# Altium schematic sheet LCD Connectors.SchDoc: LCD Connectors
size A4; DocumentNumber: MB1246; Revision: B.1; SheetNumber: 6; SheetTotal: 17; Project: STM32H7xxI-EVAL
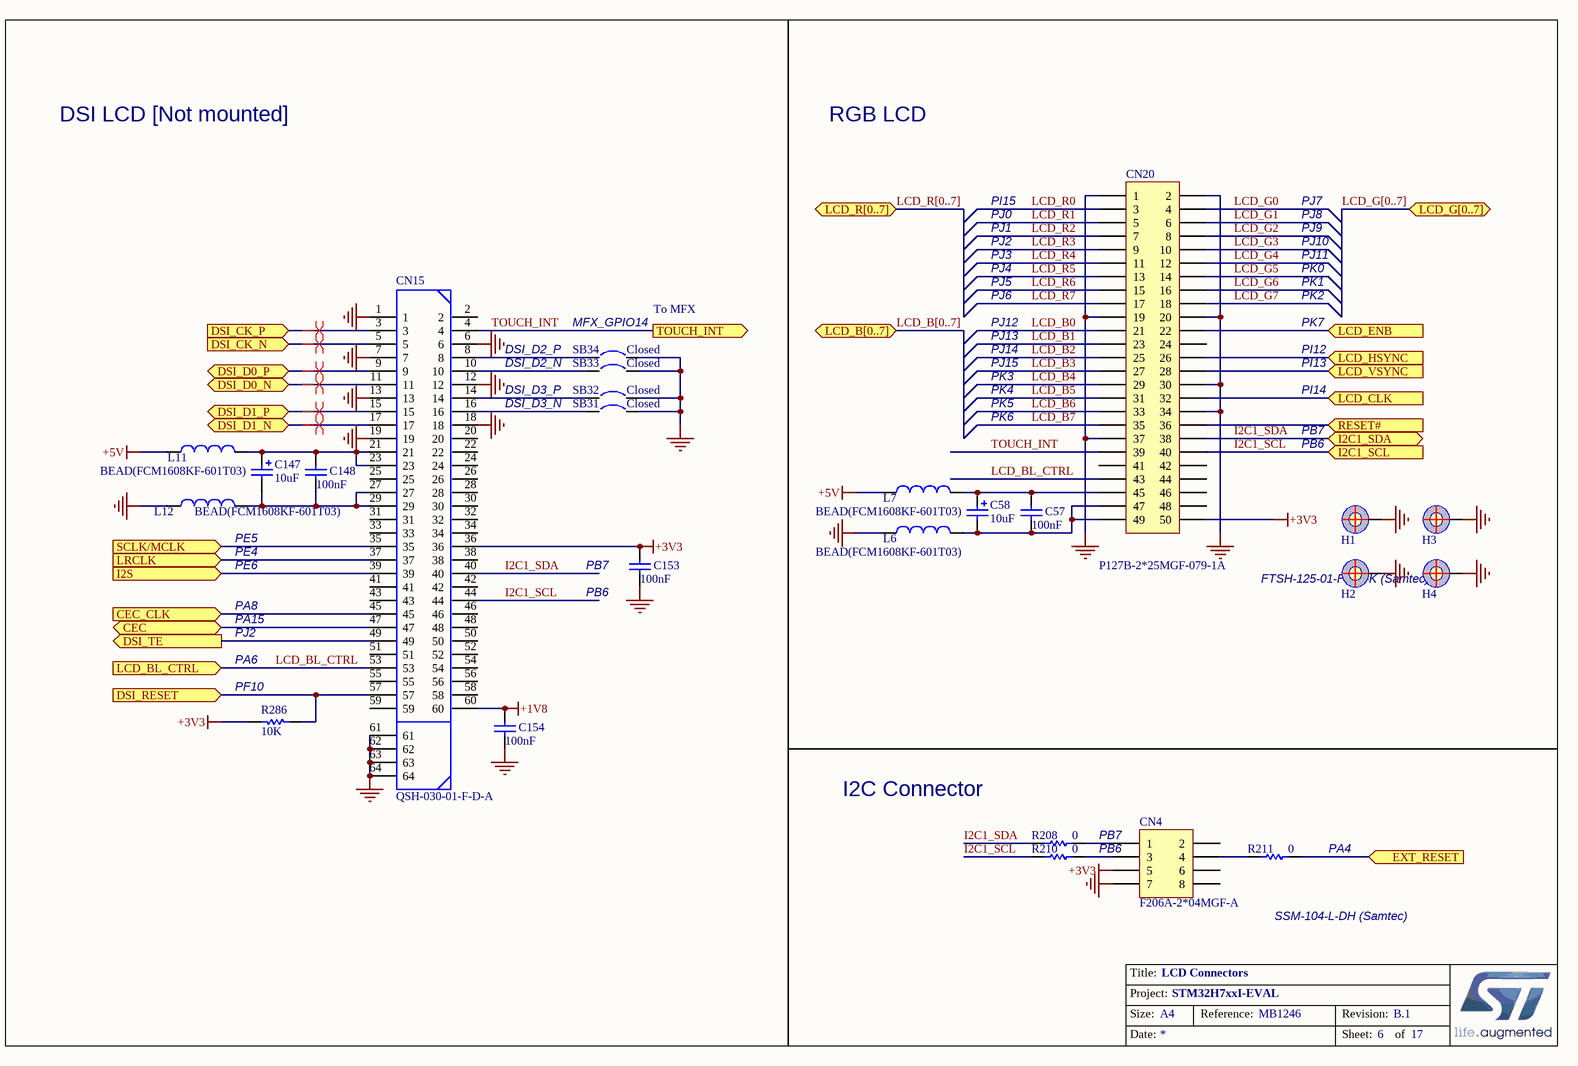
[diagram p0: LCD Connectors.SchDoc]

## Parts
C57  100nF  [0603C]
C58  10uF  [TAN-A]
C147  10uF  [TAN-A]
C148  100nF  [0603C]
C153  100nF  [0603C]
C154  100nF  [0603C]
CN4  F206A-2*04MGF-A  [SSM-104-L-DH]
CN15  QSH-030-01-F-D-A  [QSH-030-01-F-D-A]
CN20  P127B-2*25MGF-079-1A  [FTSH-125-01-F-DV]
H1  POSITION HOLE  [HOLE_C9D4R5]  (value not drawn)
H2  POSITION HOLE  [HOLE_C9D4R5]  (value not drawn)
H3  POSITION HOLE  [HOLE_C9D4R5]  (value not drawn)
H4  POSITION HOLE  [HOLE_C9D4R5]  (value not drawn)
L6  BEAD(FCM1608KF-601T03)  [0603L]
L7  BEAD(FCM1608KF-601T03)  [0603L]
L11  BEAD(FCM1608KF-601T03)  [0603L]
L12  BEAD(FCM1608KF-601T03)  [0603L]
R208  0  [0603R]
R210  0  [0603R]
R211  0  [0603R]
R286  10K  [0603R]
SB31  Closed  [SB_0603]
SB32  Closed  [SB_0603]
SB33  Closed  [SB_0603]
SB34  Closed  [SB_0603]

## Ports
CEC (bidir), CEC_CLK (in), DSI_CK_N (in), DSI_CK_P (in), DSI_D0_N (bidir), DSI_D0_P (bidir), DSI_D1_N (bidir), DSI_D1_P (bidir), DSI_RESET (in), DSI_TE (out), EXT_RESET (in), I2C1_SCL (in), I2C1_SDA (bidir), I2S (in), LCD_B[0..7] (bidir), LCD_BL_CTRL (in), LCD_CLK (in), LCD_ENB (in), LCD_G[0..7] (bidir), LCD_HSYNC (in), LCD_R[0..7] (bidir), LCD_VSYNC (in), LRCLK (in), RESET# (in), SCLK/MCLK (in), TOUCH_INT (out)

## Nets
+1V8: C154.1 CN15.60
+3V3: C153.1 CN4.5 CN15.36 CN20.50 R286.2
+5V: L7.1 L11.1
GND: C153.2 C154.2 CN4.7 CN15.1 CN15.6 CN15.7 CN15.12 CN15.13 CN15.18 CN15.19 CN15.61 CN15.62 CN15.63 CN15.64 CN20.1 CN20.2 CN20.19 CN20.20 CN20.30 CN20.34 CN20.37 H1.1 H2.1 H3.1 H4.1 L6.1 L12.1 SB31.2 SB32.2 SB33.2 SB34.2
CEC: CN15.47 ; port CEC
CEC_CLK: CN15.45 ; port CEC_CLK
DSI_CK_N: CN15.5 ; port DSI_CK_N
DSI_CK_P: CN15.3 ; port DSI_CK_P
DSI_D0_N: CN15.11 ; port DSI_D0_N
DSI_D0_P: CN15.9 ; port DSI_D0_P
DSI_D1_N: CN15.17 ; port DSI_D1_N
DSI_D1_P: CN15.15 ; port DSI_D1_P
DSI_RESET: CN15.57 R286.1 ; port DSI_RESET
DSI_TE: CN15.49 ; port DSI_TE
EXT_RESET: R211.2 ; port EXT_RESET
I2C1_SCL: CN15.44 CN20.40 R210.1 ; port I2C1_SCL
I2C1_SDA: CN15.40 CN20.38 R208.1 ; port I2C1_SDA
I2S: CN15.39 ; port I2S
LCD_B0: CN20.21
LCD_B1: CN20.23
LCD_B2: CN20.25
LCD_B3: CN20.27
LCD_B4: CN20.29
LCD_B5: CN20.31
LCD_B6: CN20.33
LCD_B7: CN20.35
LCD_BL_CTRL: CN15.53 CN20.43 ; port LCD_BL_CTRL
LCD_CLK: CN20.32 ; port LCD_CLK
LCD_ENB: CN20.22 ; port LCD_ENB
LCD_G0: CN20.4
LCD_G1: CN20.6
LCD_G2: CN20.8
LCD_G3: CN20.10
LCD_G4: CN20.12
LCD_G5: CN20.14
LCD_G6: CN20.16
LCD_G7: CN20.18
LCD_HSYNC: CN20.26 ; port LCD_HSYNC
LCD_R0: CN20.3
LCD_R1: CN20.5
LCD_R2: CN20.7
LCD_R3: CN20.9
LCD_R4: CN20.11
LCD_R5: CN20.13
LCD_R6: CN20.15
LCD_R7: CN20.17
LCD_VSYNC: CN20.28 ; port LCD_VSYNC
LRCLK: CN15.37 ; port LRCLK
RESET#: CN20.36 ; port RESET#
SCLK/MCLK: CN15.35 ; port SCLK/MCLK
TOUCH_INT: CN15.4 CN20.39 ; port TOUCH_INT
NetC57_1: C57.1 C58.1 CN20.45 L7.2
NetC57_2: C57.2 C58.2 CN20.47 CN20.49 L6.2
NetC147_1: C147.1 C148.1 CN15.21 CN15.23 L11.2
NetC147_2: C147.2 C148.2 CN15.27 CN15.29 L12.2
NetCN4_1: CN4.1 R208.2
NetCN4_3: CN4.3 R210.2
NetCN4_4: CN4.4 R211.1
NetCN15_8: CN15.8 SB34.1
NetCN15_10: CN15.10 SB33.1
NetCN15_14: CN15.14 SB32.1
NetCN15_16: CN15.16 SB31.1

Not connected (* = marked no-connect by the designer): CN4 2 6 8; CN15 2 20 22 24 25 26 28 30 31 32 33 34 38 41 42 43 46 48 50 51 52 54 55 56 58 59; CN20 24 41 42 44 46 48

## Buses and harness runs
bus LCD_B[0..7] = port LCD_B[0..7]
bus LCD_G[0..7] = port LCD_G[0..7]
bus LCD_R[0..7] = port LCD_R[0..7]

## Layout directives
differential pair: DSI_CK_N, DSI_CK_P, DSI_D0_N, DSI_D0_P, DSI_D1_N, DSI_D1_P

## Notes on the sheet
- DSI LCD [Not mounted]
- RGB LCD
- PI15
- PJ0
- PJ1
- PJ2
- PJ3
- PJ7
- PJ8
- PJ9
- PJ10
- PJ11
- MFX_GPIO14
- To MFX
- PJ4
- PJ5
- PJ6
- PJ12
- PK0
- PK1
- PK2
- PK7
- DSI_D2_P
- DSI_D2_N
- DSI_D3_P
- PJ13
- PJ14
- PJ15
- PK3
- PK4
- PI12
- PI13
- PI14
- DSI_D3_N
- PK5
- PK6
- PB7
- PB6
- PE6
- (near L12) PE5
- (near L12) PE4
- (near C153) PB7
- (near C153) PB6
- FTSH-125-01-F-DV-K (Samtec)
- PA6
- PA15
- PA8
- (near R286) PF10
- I2C Connector
- (near R211) PA4
- (near CN4) SSM-104-L-DH (Samtec)
- Title:
- Project:
- Size:
- Date:
- A4
- Reference:
- Sheet:
- Revision:
- of

## Library data of the parts
C57 C148 C153 C154 = Cap: Capacitor; Value: 10nF; Published: 8-Jun-2000; Revision: July-2002: Re-released for DXP Platform.; Publisher: Altium Limited
C58 C147 = Cap Pol1: Polarized Capacitor (Radial); Published: 8-Jun-2000; Revision: July-2002: Re-released for DXP Platform.; Publisher: Altium Limited; Value: 10uF
CN4 = SSM-104-L-DH: Header, 5-Pin, Dual row; Revision: 17-Jul-2002: Re-released for DXP Platform.; Publisher: Altium Limited
CN15 = QSH-030-01-F-D-A: HIGH SPEED SOCKET STRIP, .5mm PITCH, 60 PINS; MANUFACTURER: SAMTEC; PCB DECAL: QSH-030-01-X-D-A; CREATED: 28 JAN 2014 - WENDY XIN
CN20 = Header 25X2: Header, 26-Pin, Dual row; Revision: 17-Jul-2002: Re-released for DXP Platform.; Publisher: Altium Limited
L6 L7 L11 L12 = Inductor: Value: 100uH; Published: 8-Jun-2000; Revision: July-2002: Re-released for DXP Platform.; Publisher: Altium Limited
R208 R210 R211 R286 = Res1: Resistor; Value: 1K; Published: 8-Jun-2000; Revision: July-2002: Re-released for DXP Platform.; Publisher: Altium Limited
SB31-SB34 = Circuit Breaker_close: Circuit Breaker; Published: 24-Mar-1999; Revision: July-2002: Re-released for DXP Platform.; Publisher: Altium Limited